# EAGLE design Motherboard_STM32F405RG (EAGLE 7.7.0)

## Sheet 1 of 2
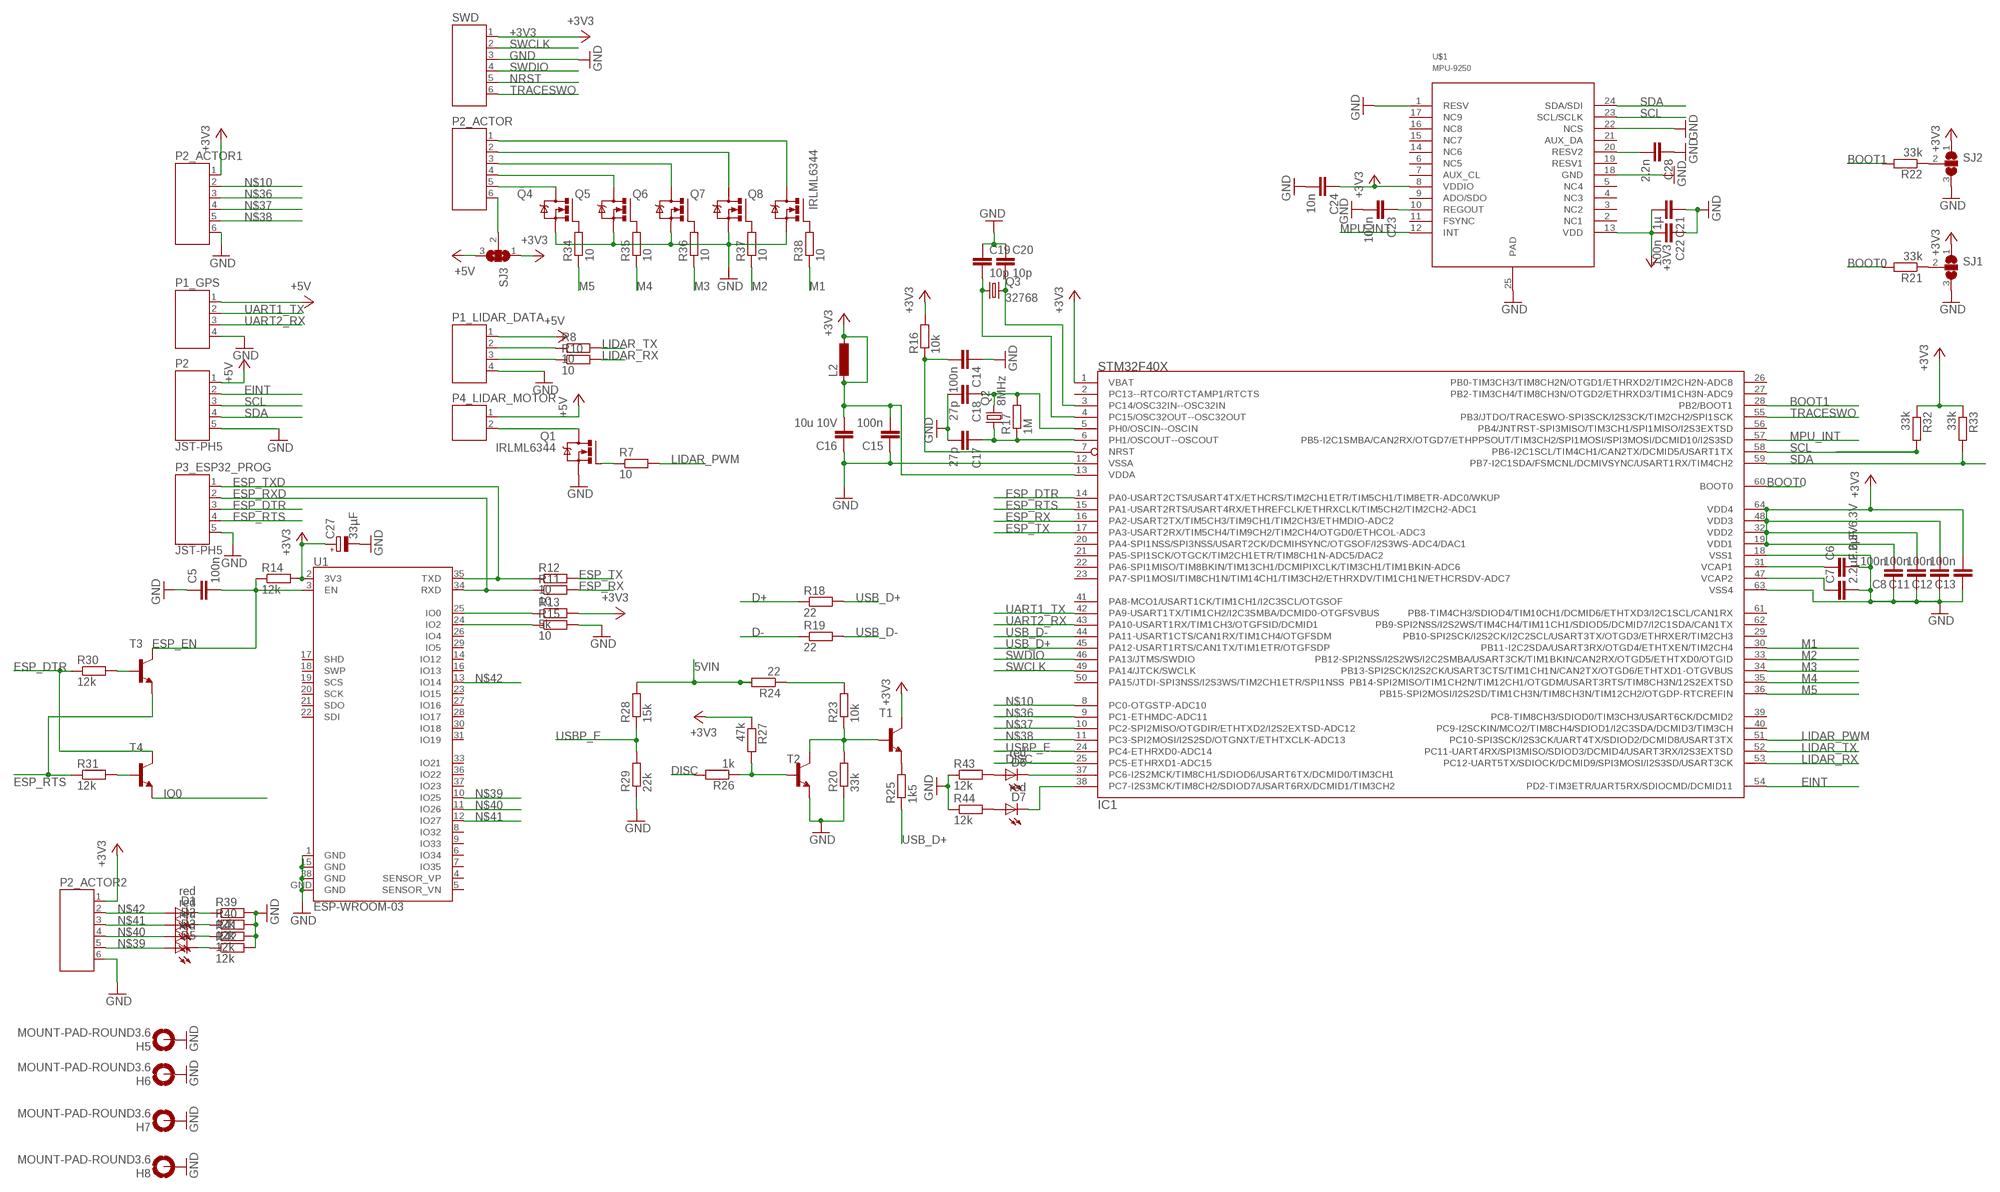
[diagram p0: schematic, sheet 1]

### Parts
C5  100n  C-EUC0603  [C0603]
C6  2.2µF 6.3V  C-EUC0603  [C0603]
C7  2.2µF 6.3V  C-EUC0603  [C0603]
C8  100n  C-EUC0603  [C0603]
C11  100n  C-EUC0603  [C0603]
C12  100n  C-EUC0603  [C0603]
C13  100n  C-EUC0603  [C0603]
C14  100n  C-EUC0603  [C0603]
C15  100n  C-EUC0603  [C0603]
C16  10u 10V  C-EUC1206  [C1206]
C17  27p  C-EUC0603  [C0603]
C18  27p  C-EUC0603  [C0603]
C19  10p  C-EUC0603  [C0603]
C20  10p  C-EUC0603  [C0603]
C21  1µ  C-EUC0603  [C0603]
C22  100n  C-EUC0603  [C0603]
C23  100n  C-EUC0603  [C0603]
C24  10n  C-EUC0603  [C0603]
C27  33µF  CPOL-EUA/3216-18W  [A/3216-18W]
C28  2.2n  C-EUC0603  [C0603]
D1  red  LED0603  [LED-0603]
D2  red  LED0603  [LED-0603]
D3  red  LED0603  [LED-0603]
D5  red  LED0603  [LED-0603]
D6  red  LED0603  [LED-0603]
D7  red  LED0603  [LED-0603]
H5  MOUNT-PAD-ROUND3.6  [3,6-PAD]
H6  MOUNT-PAD-ROUND3.6  [3,6-PAD]
H7  MOUNT-PAD-ROUND3.6  [3,6-PAD]
H8  MOUNT-PAD-ROUND3.6  [3,6-PAD]
IC1  STM32F40X  [LQFP64]
L2  L-EUL1812  [L1812]
P1_GPS  JST-PH4  [JST-PH4]
P1_LIDAR_DATA  JST-PH4  [JST-PH4]
P2  JST-PH5  [JST-PH5]
P2_ACTOR  JST-PH6  [JST-PH6]
P2_ACTOR1  JST-PH6  [JST-PH6]
P2_ACTOR2  JST-PH6  [JST-PH6]
P3_ESP32_PROG  JST-PH5  [JST-PH5]
P4_LIDAR_MOTOR  JST-PH2  [JST-PH2]
Q1  IRLML6344  [SOT23]
Q2  8MHz  CRYSTALHC18U-V  [HC18U-V]
Q3  32768  CRYSTALTC38H  [TC38H]
Q4  IRLML6344  [SOT23]
Q5  IRLML6344  [SOT23]
Q6  IRLML6344  [SOT23]
Q7  IRLML6344  [SOT23]
Q8  IRLML6344  [SOT23]
R7  10  R-EU_R0603  [R0603]
R8  10  R-EU_R0603  [R0603]
R10  10  R-EU_R0603  [R0603]
R11  10  R-EU_R0603  [R0603]
R12  10  R-EU_R0603  [R0603]
R13  5k  R-EU_R0603  [R0603]
R14  12k  R-EU_R0603  [R0603]
R15  10  R-EU_R0603  [R0603]
R16  10k  R-EU_R0603  [R0603]
R17  1M  R-EU_R0603  [R0603]
R18  22  R-EU_R0603  [R0603]
R19  22  R-EU_R0603  [R0603]
R20  33k  R-EU_R0603  [R0603]
R21  33k  R-EU_R0603  [R0603]
R22  33k  R-EU_R0603  [R0603]
R23  10k  R-EU_R0603  [R0603]
R24  22  R-EU_R0603  [R0603]
R25  1k5  R-EU_R0603  [R0603]
R26  1k  R-EU_R0603  [R0603]
R27  47k  R-EU_R0603  [R0603]
R28  15k  R-EU_R0603  [R0603]
R29  22k  R-EU_R0603  [R0603]
R30  12k  R-EU_R0603  [R0603]
R31  12k  R-EU_R0603  [R0603]
R32  33k  R-EU_R0603  [R0603]
R33  33k  R-EU_R0603  [R0603]
R34  10  R-EU_R0603  [R0603]
R35  10  R-EU_R0603  [R0603]
R36  10  R-EU_R0603  [R0603]
R37  10  R-EU_R0603  [R0603]
R38  10  R-EU_R0603  [R0603]
R39  12k  R-EU_R0603  [R0603]
R40  12k  R-EU_R0603  [R0603]
R41  12k  R-EU_R0603  [R0603]
R42  12k  R-EU_R0603  [R0603]
R43  12k  R-EU_R0603  [R0603]
R44  12k  R-EU_R0603  [R0603]
SJ1  SJ2W  [SJ_2]
SJ2  SJ2W  [SJ_2]
SJ3  SJ2W  [SJ_2]
SWD  JST-PH6  [JST-PH6]
T1  BC817-16-NPN-SOT23-BEC  [SOT23-BEC]
T2  BC817-16-NPN-SOT23-BEC  [SOT23-BEC]
T3  BC817-16-NPN-SOT23-BEC  [SOT23-BEC]
T4  BC817-16-NPN-SOT23-BEC  [SOT23-BEC]
U1  ESP-WROOM-03  [ESP-WROOM-03]
U$1  MPU-9250  [LEAD-QFN24]

### Nets
5VIN: R24.2 R28.2 ; also sheet 2
+3V3: C8.2 C11.2 C12.2 C13.2 C15.2 C16.2 C21.2 C22.2 C24.1 C27.+ IC1.1(VBAT) IC1.13(VDDA) IC1.19(VDD1) IC1.32(VDD2) IC1.48(VDD3) IC1.64(VDD4) L2.1 L2.2 P2_ACTOR1.1 P2_ACTOR2.1 R13.2 R14.2 R16.2 R27.1 R32.1 R33.1 SJ1.1 SJ2.1 SJ3.1 SWD.1 T1.C U1.2(3V3) U$1.8(VDDIO) U$1.13(VDD) ; also sheet 2
+5V: P1_GPS.1 P1_LIDAR_DATA.1 P2.1 P4_LIDAR_MOTOR.1 SJ3.3 ; also sheet 2
BOOT0: IC1.60(BOOT0) R21.2
BOOT1: IC1.28(PB2/BOOT1) R22.2
D+: R18.1 ; also sheet 2
D-: R19.1 ; also sheet 2
DISC: IC1.25(PC5-ETHRXD1-ADC15) R26.2
EINT: IC1.54(PD2-TIM3ETR/UART5RX/SDIOCMD/DCMID11) P2.2
ESP_DTR: IC1.14(PA0-USART2CTS/USART4TX/ETHCRS/TIM2CH1ETR/TIM5CH1/TIM8ETR-ADC0/WKUP) P3_ESP32_PROG.3 R30.1 T4.C
ESP_EN: C5.2 R14.1 T3.C U1.3(EN)
ESP_RTS: IC1.15(PA1-USART2RTS/USART4RX/ETHREFCLK/ETHRXCLK/TIM5CH2/TIM2CH2-ADC1) P3_ESP32_PROG.4 R31.1 T3.E
ESP_RX: IC1.16(PA2-USART2TX/TIM5CH3/TIM9CH1/TIM2CH3/ETHMDIO-ADC2) R11.2
ESP_RXD: P3_ESP32_PROG.2 R11.1 U1.34(RXD)
ESP_TX: IC1.17(PA3-USART2RX/TIM5CH4/TIM9CH2/TIM2CH4/OTGD0/ETHCOL-ADC3) R12.2
ESP_TXD: P3_ESP32_PROG.1 R12.1 U1.35(TXD)
GND: C5.1 C6.2 C7.2 C8.1 C11.1 C12.1 C13.1 C14.1 C15.1 C16.1 C17.2 C18.2 C19.1 C20.1 C21.1 C22.1 C23.2 C24.2 C27.- C28.1 H5.B3,6(MOUNT) H6.B3,6(MOUNT) H7.B3,6(MOUNT) H8.B3,6(MOUNT) IC1.12(VSSA) IC1.18(VSS1) IC1.63(VSS4) P1_GPS.4 P1_LIDAR_DATA.4 P2.5 P2_ACTOR1.6 P2_ACTOR2.6 P3_ESP32_PROG.5 Q1.2(S) Q4.2(S) Q5.2(S) Q6.2(S) Q7.2(S) Q8.2(S) R15.2 R20.1 R29.1 R39.2 R40.2 R41.2 R42.2 R43.1 R44.1 SJ1.3 SJ2.3 SWD.3 T2.E U1.1(GND) U1.15(GND) U1.38(GND) U1.GND U$1.1(RESV) U$1.18(GND) U$1.22(NCS) U$1.25(PAD) ; also sheet 2
IO0: R13.1 T4.E U1.25(IO0)
IO2: R15.1 U1.24(IO2)
LIDAR_PWM: IC1.51(PC10-SPI3SCK/I2S3CK/UART4TX/SDIOD2/DCMID8/USART3TX) R7.2
LIDAR_RX: IC1.53(PC12-UART5TX/SDIOCK/DCMID9/SPI3MOSI/I2S3SD/USART3CK) R10.2
LIDAR_TX: IC1.52(PC11-UART4RX/SPI3MISO/SDIOD3/DCMID4/USART3RX/I2S3EXTSD) R8.2
M1: IC1.30(PB11-I2C2SDA/USART3RX/OTGD4/ETHTXEN/TIM2CH4) R38.1
M2: IC1.33(PB12-SPI2NSS/I2S2WS/I2C2SMBA/USART3CK/TIM1BKIN/CAN2RX/OTGD5/ETHTXD0/OTGID) R37.1
M3: IC1.34(PB13-SPI2SCK/I2S2CK/USART3CTS/TIM1CH1N/CAN2TX/OTGD6/ETHTXD1-OTGVBUS) R36.1
M4: IC1.35(PB14-SPI2MISO/TIM1CH2N/TIM12CH1/OTGDM/USART3RTS/TIM8CH3N/12S2EXTSD) R35.1
M5: IC1.36(PB15-SPI2MOSI/I2S2SD/TIM1CH3N/TIM8CH3N/TIM12CH2/OTGDP-RTCREFIN) R34.1
MPU_INT: IC1.57(PB5-I2C1SMBA/CAN2RX/OTGD7/ETHPPSOUT/TIM3CH2/SPI1MOSI/SPI3MOSI/DCMID10/I2S3SD) U$1.12(INT)
N$3: C28.2 U$1.20(RESV2)
N$4: P4_LIDAR_MOTOR.2 Q1.3(D)
N$5: Q1.1(G) R7.1
N$6: P1_LIDAR_DATA.2 R8.1
N$7: P1_LIDAR_DATA.3 R10.1
N$9: C23.1 U$1.10(REGOUT)
N$10: IC1.8(PC0-OTGSTP-ADC10) P2_ACTOR1.2
N$12: P2_ACTOR.5 Q4.3(D)
N$13: R31.2 T4.B
N$15: P2_ACTOR.4 Q5.3(D)
N$16: C17.1 IC1.6(PH1/OSCOUT--OSCOUT) Q2.1 R17.1
N$17: P2_ACTOR.3 Q6.3(D)
N$18: P2_ACTOR.2 Q7.3(D)
N$19: C18.1 IC1.5(PH0/OSCIN--OSCIN) Q2.2 R17.2
N$20: C19.2 IC1.4(PC15/OSC32OUT--OSC32OUT) Q3.1
N$21: C20.2 IC1.3(PC14/OSC32IN--OSC32IN) Q3.2
N$22: R20.2 R23.1 T1.B T2.C
N$23: R21.1 SJ1.2
N$24: R22.1 SJ2.2
N$25: P2_ACTOR.1 Q8.3(D)
N$26: R25.2 T1.E
N$27: R23.2 R24.1
N$28: R26.1 R27.2 T2.B
N$29: R30.2 T3.B
N$30: P2_ACTOR.6 SJ3.2
N$31: Q4.1(G) R34.2
N$32: Q5.1(G) R35.2
N$33: Q6.1(G) R36.2
N$34: Q7.1(G) R37.2
N$35: Q8.1(G) R38.2
N$36: IC1.9(PC1-ETHMDC-ADC11) P2_ACTOR1.3
N$37: IC1.10(PC2-SPI2MISO/OTGDIR/ETHTXD2/I2S2EXTSD-ADC12) P2_ACTOR1.4
N$38: IC1.11(PC3-SPI2MOSI/I2S2SD/OTGNXT/ETHTXCLK-ADC13) P2_ACTOR1.5
N$39: D5.A P2_ACTOR2.5 U1.10(IO25)
N$40: D3.A P2_ACTOR2.4 U1.11(IO26)
N$41: D2.A P2_ACTOR2.3 U1.12(IO27)
N$42: D1.A P2_ACTOR2.2 U1.13(IO14)
N$43: D1.C R39.1
N$44: D2.C R40.1
N$45: D3.C R41.1
N$46: D5.C R42.1
N$48: D6.C IC1.37(PC6-I2S2MCK/TIM8CH1/SDIOD6/USART6TX/DCMID0/TIM3CH1)
N$49: D7.C IC1.38(PC7-I2S3MCK/TIM8CH2/SDIOD7/USART6RX/DCMID1/TIM3CH2)
N$50: D6.A R43.2
N$51: D7.A R44.2
NRST: C14.2 IC1.7(NRST) R16.1 SWD.5
SCL: IC1.58(PB6-I2C1SCL/TIM4CH1/CAN2TX/DCMID5/USART1TX) P2.3 R32.2 U$1.23(SCL/SCLK)
SDA: IC1.59(PB7-I2C1SDA/FSMCNL/DCMIVSYNC/USART1RX/TIM4CH2) P2.4 R33.2 U$1.24(SDA/SDI)
SWCLK: IC1.49(PA14/JTCK/SWCLK) SWD.2
SWDIO: IC1.46(PA13/JTMS/SWDIO) SWD.4
TRACESWO: IC1.55(PB3/JTDO/TRACESWO-SPI3SCK/I2S3CK/TIM2CH2/SPI1SCK) SWD.6
UART1_TX: IC1.42(PA9-USART1TX/TIM1CH2/I2C3SMBA/DCMID0-OTGFSVBUS) P1_GPS.2
UART2_RX: IC1.43(PA10-USART1RX/TIM1CH3/OTGFSID/DCMID1) P1_GPS.3
USB_D+: IC1.45(PA12-USART1RTS/CAN1TX/TIM1ETR/OTGFSDP) R18.2 R25.1
USB_D-: IC1.44(PA11-USART1CTS/CAN1RX/TIM1CH4/OTGFSDM) R19.2
USBP_E: IC1.24(PC4-ETHRXD0-ADC14) R28.1 R29.2
VCAP1: C6.1 IC1.31(VCAP1)
VCAP2: C7.1 IC1.47(VCAP2)
Unconnected: IC1.2(PC13--RTCO/RTCTAMP1/RTCTS) IC1.20(PA4-SPI1NSS/SPI3NSS/USART2CK/DCMIHSYNC/OTGSOF/I2S3WS-ADC4/DAC1) IC1.21(PA5-SPI1SCK/OTGCK/TIM2CH1ETR/TIM8CH1N-ADC5/DAC2) IC1.22(PA6-SPI1MISO/TIM8BKIN/TIM13CH1/DCMIPIXCLK/TIM3CH1/TIM1BKIN-ADC6) IC1.23(PA7-SPI1MOSI/TIM8CH1N/TIM14CH1/TIM3CH2/ETHRXDV/TIM1CH1N/ETHCRSDV-ADC7) IC1.26(PB0-TIM3CH3/TIM8CH2N/OTGD1/ETHRXD2/TIM2CH2N-ADC8) IC1.27(PB2-TIM3CH4/TIM8CH3N/OTGD2/ETHRXD3/TIM1CH3N-ADC9) IC1.29(PB10-SPI2SCK/I2S2CK/I2C2SCL/USART3TX/OTGD3/ETHRXER/TIM2CH3) IC1.39(PC8-TIM8CH3/SDIOD0/TIM3CH3/USART6CK/DCMID2) IC1.40(PC9-I2SCKIN/MCO2/TIM8CH4/SDIOD1/I2C3SDA/DCMID3/TIM3CH) IC1.41(PA8-MCO1/USART1CK/TIM1CH1/I2C3SCL/OTGSOF) IC1.50(PA15/JTDI-SPI3NSS/I2S3WS/TIM2CH1ETR/SPI1NSS) IC1.56(PB4/JNTRST-SPI3MISO/TIM3CH1/SPI1MISO/I2S3EXTSD) IC1.61(PB8-TIM4CH3/SDIOD4/TIM10CH1/DCMID6/ETHTXD3/I2C1SCL/CAN1RX) IC1.62(PB9-SPI2NSS/I2S2WS/TIM4CH4/TIM11CH1/SDIOD5/DCMID7/I2C1SDA/CAN1TX) U1.4(SENSOR_VP) U1.5(SENSOR_VN) U1.6(IO34) U1.7(IO35) U1.8(IO32) U1.9(IO33) U1.14(IO12) U1.16(IO13) U1.17(SHD) U1.18(SWP) U1.19(SCS) U1.20(SCK) U1.21(SDO) U1.22(SDI) U1.23(IO15) U1.26(IO4) U1.27(IO16) U1.28(IO17) U1.29(IO5) U1.30(IO18) U1.31(IO19) U1.33(IO21) U1.36(IO22) U1.37(IO23) U$1.2(NC1) U$1.3(NC2) U$1.4(NC3) U$1.5(NC4) U$1.6(NC5) U$1.7(AUX_CL) U$1.9(ADO/SDO) U$1.11(FSYNC) U$1.14(NC6) U$1.15(NC7) U$1.16(NC8) U$1.17(NC9) U$1.19(RESV1) U$1.21(AUX_DA)

## Sheet 2 of 2
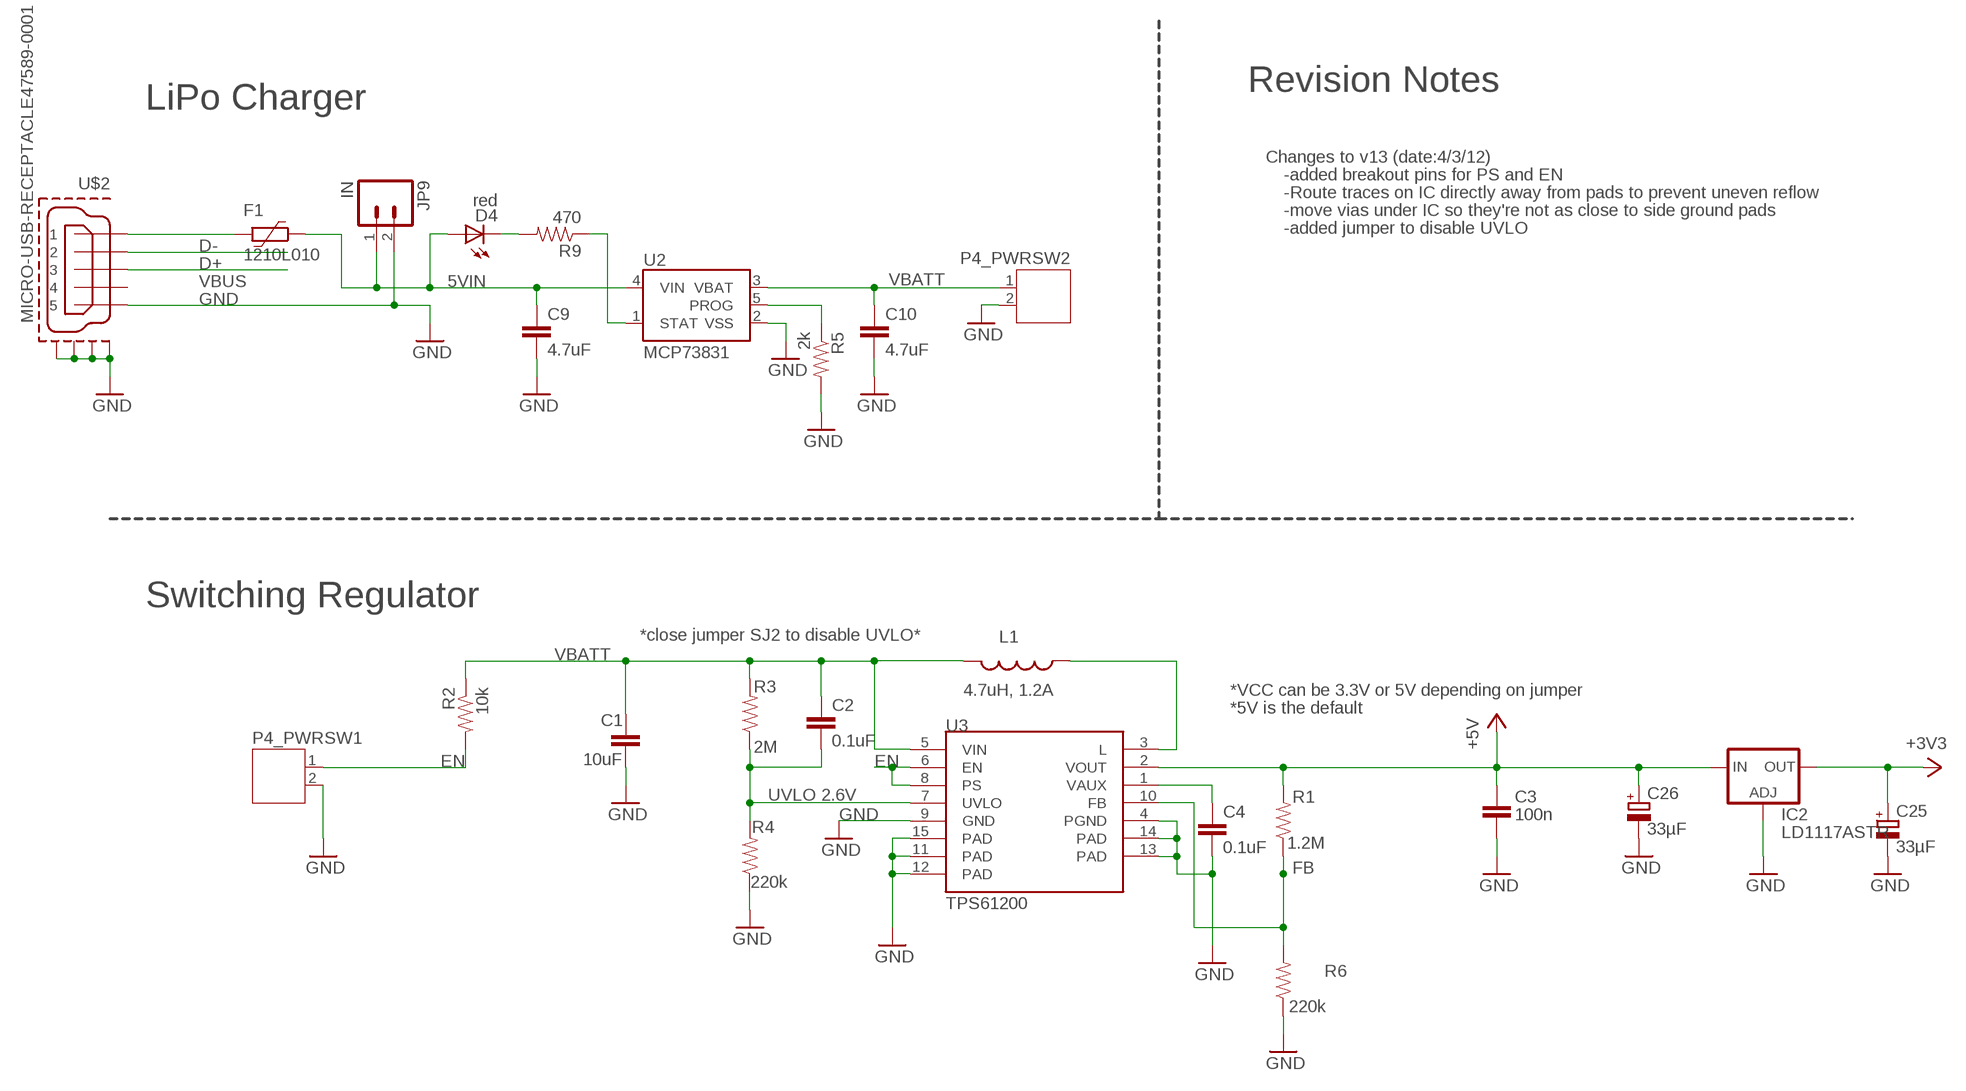
[diagram p1: schematic, sheet 2]

### Parts
C1  10uF  CAP1206  [1206]
C2  0.1uF  CAP0603-CAP  [0603-CAP]
C3  100n  CAP0805  [0805]
C4  0.1uF  CAP0603-CAP  [0603-CAP]
C9  4.7uF  CAP0603-CAP  [0603-CAP]
C10  4.7uF  CAP0603-CAP  [0603-CAP]
C25  33µF  CPOL-EUA/3216-18W  [A/3216-18W]
C26  33µF  CPOL-EUA/3216-18W  [A/3216-18W]
D4  red  LED0603  [LED-0603]
F1  1210L010  [1210L]
IC2  LD1117ASTR  LD117ASTR  [SOT223]
JP9  IN  M02PTH  [1X02]
L1  4.7uH, 1.2A  INDUCTOR.  [CDRH2D09]
P4_PWRSW1  JST-PH2  [JST-PH2]
P4_PWRSW2  JST-PH2  [JST-PH2]
R1  1.2M  RESISTOR0603-RES  [0603-RES]
R2  10k  RESISTOR0603-RES  [0603-RES]
R3  2M  RESISTOR0603-RES  [0603-RES]
R4  220k  RESISTOR0603-RES  [0603-RES]
R5  2k  RESISTOR0603-RES  [0603-RES]
R6  220k  RESISTOR0603-RES  [0603-RES]
R9  470  RESISTOR0603-RES  [0603-RES]
U2  MCP73831  [SOT23-5]
U3  TPS61200  [QFN-10_PAD]
U$2  MICRO-USB-RECEPTACLE47589-0001  [47589-0001]

### Nets
5VIN: C9.1 D4.A F1.1 JP9.1 U2.4(VIN) ; also sheet 1
+3V3: C25.+ IC2.2(OUT) IC2.4(OUT) ; also sheet 1
+5V: C3.1 C26.+ IC2.3(IN) R1.2 U3.2(VOUT) ; also sheet 1
D+: U$2.3 ; also sheet 1
D-: U$2.2 ; also sheet 1
EN: P4_PWRSW1.1 R2.2 U3.6(EN) U3.8(PS)
FB: R1.1 R6.2 U3.10(FB)
GND: C1.2 C3.2 C4.2 C9.2 C10.2 C25.- C26.- IC2.1(ADJ) JP9.2 P4_PWRSW1.2 P4_PWRSW2.2 R4.1 R5.2 R6.1 U2.2(VSS) U3.4(PGND) U3.9(GND) U3.11(PAD) U3.12(PAD) U3.13(PAD) U3.14(PAD) U3.15(PAD) U$2.5 U$2.CASING1(GND1) U$2.CASING2(GND2) U$2.CASING3(GND3) U$2.CASING4(GND4) ; also sheet 1
N$1: C4.1 U3.1(VAUX)
N$2: L1.P$1 U3.3(L)
N$8: D4.C R9.2
N$11: R5.1 U2.5(PROG)
N$14: R9.1 U2.1(STAT)
UVLO: C2.2 R3.1 R4.2 U3.7(UVLO)
VBATT: C1.1 C2.1 C10.1 L1.P$2 P4_PWRSW2.1 R2.1 R3.2 U2.3(VBAT) U3.5(VIN)
VBUS: F1.2 U$2.1
Unconnected: U$2.4

### Notes on the sheet
- Revision Notes
- LiPo Charger
- Changes to v13 (date:4/3/12)
- -added breakout pins for PS and EN
- -Route traces on IC directly away from pads to prevent uneven reflow
- -move vias under IC so they're not as close to side ground pads
- -added jumper to disable UVLO
- Switching Regulator
- *close jumper SJ2 to disable UVLO*
- *VCC can be 3.3V or 5V depending on jumper
- *5V is the default
- UVLO 2.6V

## Library data of the parts
C1 = CH_passive:CAP: Capacitor Standard 0603 ceramic capacitor, and 0.1" leaded capacitor.; MF: KEMET; MPN: C1206C106K8RACTU; OC_FARNELL: 1288264
C2 C4 = SparkFun:CAP: Capacitor Standard 0603 ceramic capacitor, and 0.1" leaded capacitor.; MF: YAGEO (PHYCOMP); MPN: CC0603MRY5V9BB104; OC_FARNELL: 431989
C3 = CH_passive:CAP: Capacitor Standard 0603 ceramic capacitor, and 0.1" leaded capacitor.; MF: KEMET; MPN: C0603C104K5RACTU; OC_FARNELL: 1288255
C5 C8 C11-C15 C22 C23 = rcl:C-EU: CAPACITOR, European symbol; MF: KEMET; MPN: C0603C104K5RACTU; OC_FARNELL: 1288255
C6 C7 = rcl:C-EU: CAPACITOR, European symbol; MF: KEMET; MPN: C0603C225K9PACTU; OC_FARNELL: 1288257
C9 C10 = SparkFun:CAP: Capacitor Standard 0603 ceramic capacitor, and 0.1" leaded capacitor.; MF: KEMET; MPN: C0603C475K8PACTU; OC_FARNELL: 1572625
C16 = rcl:C-EU: CAPACITOR, European symbol; MF: KEMET; MPN: C1206C106K8RACTU; OC_FARNELL: 1288264
C17 C18 = rcl:C-EU: CAPACITOR, European symbol; MF: YAGEO (PHYCOMP); MPN: CC0603JRNPO9BN270; OC_FARNELL: 722017
C19 C20 = rcl:C-EU: CAPACITOR, European symbol; MF: AVX; MPN: 06035A102JAT2A; OC_FARNELL: 317202
C21 = rcl:C-EU: CAPACITOR, European symbol; MF: AVX; MPN: 0603YC105KAT2A; OC_FARNELL: 1658870
C24 = rcl:C-EU: CAPACITOR, European symbol; MF: YAGEO (PHYCOMP); MPN: CC0603KRX7R9BB103; OC_FARNELL: 722236
C25-C27 = rcl:CPOL-EU: POLARIZED CAPACITOR, European symbol; MF: AVX; MPN: TPSA336M006R0600; OC_FARNELL: 2333095
C28 = rcl:C-EU: CAPACITOR, European symbol; MF: YAGEO (PHYCOMP); MPN: CC0603KRX7R9BB222; OC_FARNELL: 722194
D1-D7 = SparkFun:LED: LEDs Standard schematic elements and footprints for 5mm, 3mm, 1206, and 0603 sized LEDs. 5mm - Spark Fun Electronics SKU : COM-00529 (and others); MF: OSRAM; MPN: LSQ976-Z; OC_FARNELL: 1226390
F1 = polyfuse-smd_10:?: Polyfuse Resettable PTC Source: http://www.littelfuse.com/products/resettable-ptcs.aspx; MF: LITTELFUSE; MPN: 1210L010WR; OC_FARNELL: 1822206; OC_NEWARK: 18M4781
H5-H8 = holes_new:MOUNT-PAD-ROUND: MOUNTING PAD, round; OC_FARNELL: unknown
IC1 = pel_stm32:STM32F40X; MF: STMICROELECTRONICS; MPN: STM32F405RGT6; OC_FARNELL: 2064363
IC2 = v-reg:LD117A?*: Low drop fixed and adjustable positive voltage regulators 1 A Source: http://www.st.com/stonline/products/literature/ds/7194/ld1117axx.pdf; MF: ON SEMICONDUCTOR; MPN: NCP1117ST33T3G; OC_FARNELL: 1652366
JP9 = SparkFun:M02: Header 2 Standard 2-pin 0.1" header. Use with straight break away headers (SKU : PRT-00116), right angle break away headers (PRT-00553), swiss pins (PRT-00743), machine pins (PRT-00117), and female headers (PRT-00115). Molex polarized connector foot print use with SKU : PRT-08233 with associated crimp pins and housings.; MF: JST (JAPAN SOLDERLESS TERMINALS); MPN: B2B-PH-K-S(LF)(SN); OC_FARNELL: 9491856
L1 = SparkFun:INDUCTOR: Inductors Basic Inductor/Choke - 0603 and 1206. Footprints are not proven and vary greatly between part numbers.; MF: MURATA; MPN: LQH3NPN4R7MJ0L; OC_FARNELL: 2219271
L2 = rcl:L-EU: INDUCTOR, European symbol; OC_FARNELL: unknown
P1_GPS P1_LIDAR_DATA = jst-ph:JST-PH4; MF: JST (JAPAN SOLDERLESS TERMINALS); MPN: B4B-PH-K-S(LF)(SN); OC_FARNELL: 9492437
P2 P3_ESP32_PROG = jst-ph:JST-PH5; MF: JST (JAPAN SOLDERLESS TERMINALS); MPN: B5B-PH-K-S(LF)(SN); OC_FARNELL: 9492445
P2_ACTOR P2_ACTOR1 P2_ACTOR2 SWD = jst-ph:JST-PH6; MF: JST (JAPAN SOLDERLESS TERMINALS); MPN: B6B-PH-K-S(LF)(SN); OC_FARNELL: 9492453
P4_LIDAR_MOTOR P4_PWRSW1 P4_PWRSW2 = jst-ph:JST-PH2; MF: JST (JAPAN SOLDERLESS TERMINALS); MPN: B2B-PH-K-S(LF)(SN); OC_FARNELL: 9491856
Q1 Q4-Q8 = myDBv7:IRLML6344; MF: INFINEON; MPN: IRLML6344TRPBF; OC_FARNELL: 1857299
Q2 = crystal:CRYSTAL: CRYSTAL; MF: MULTICOMP; MPN: HC49S-8-30-50-70-30-ATF; OC_FARNELL: 1666997; OC_NEWARK: unknown
Q3 = crystal:CRYSTAL: CRYSTAL; MF: CITIZEN FINETECH MIYOTA; MPN: CFS206 32.768KDZB-UB; OC_FARNELL: 1457085; OC_NEWARK: unknown
R1 = SparkFun:RESISTOR: Resistor Basic schematic elements and footprints for 0603, 1206, and PTH resistors.; MF: MULTICOMP; MPN: MCMR06W2004FTL; OC_FARNELL: 2073340
R2 = SparkFun:RESISTOR: Resistor Basic schematic elements and footprints for 0603, 1206, and PTH resistors.; MF: MULTICOMP; MPN: MCMR06X1002FTL; OC_FARNELL: 2073349
R3 = SparkFun:RESISTOR: Resistor Basic schematic elements and footprints for 0603, 1206, and PTH resistors.; MF: KOA SPEER ELECTRONICS; MPN: RK73H1JTTD1204F; OC_FARNELL: 1811595
R4 R6 = SparkFun:RESISTOR: Resistor Basic schematic elements and footprints for 0603, 1206, and PTH resistors.; MF: MULTICOMP; MPN: MCHP03W8F2203T5E; OC_FARNELL: 1576314
R5 = SparkFun:RESISTOR: Resistor Basic schematic elements and footprints for 0603, 1206, and PTH resistors.; MF: YAGEO (PHYCOMP); MPN: RC0603FR-072K2L.; OC_FARNELL: 9238522
R7 R8 R10-R16 R34-R38 = rcl:R-EU_: RESISTOR, European symbol; MF: VISHAY; MPN: CRCW060310R0FKEA; OC_FARNELL: 1469751
R9 = SparkFun:RESISTOR: Resistor Basic schematic elements and footprints for 0603, 1206, and PTH resistors.; MF: MULTICOMP; MPN: MCHP03W8F4700T5E; OC_FARNELL: 1576273
R17 = rcl:R-EU_: RESISTOR, European symbol; MF: VISHAY; MPN: CRCW06031M00FKEA; OC_FARNELL: 1469746
R18 R19 R24 = rcl:R-EU_: RESISTOR, European symbol; MF: VISHAY; MPN: CRCW060322R0FKEA; OC_FARNELL: 1469781
R20-R22 R32 R33 = rcl:R-EU_: RESISTOR, European symbol; MF: VISHAY; MPN: CRCW060333K0FKEA; OC_FARNELL: 1469801
R23 = rcl:R-EU_: RESISTOR, European symbol; MF: MULTICOMP; MPN: MCMR06X1002FTL; OC_FARNELL: 2073349
R25 = rcl:R-EU_: RESISTOR, European symbol; MF: MULTICOMP; MPN: MCMR06X1501FTL; OC_FARNELL: 2073391
R26 = rcl:R-EU_: RESISTOR, European symbol; MF: VISHAY; MPN: CRCW06031K00FKEA; OC_FARNELL: 1469740
R27 = rcl:R-EU_: RESISTOR, European symbol; MF: VISHAY; MPN: CRCW060347K0FKEA; OC_FARNELL: 1469811
R28 = rcl:R-EU_: RESISTOR, European symbol; MF: VISHAY; MPN: CRCW060315K0FKEA; OC_FARNELL: 1469758
R29 = rcl:R-EU_: RESISTOR, European symbol; MF: TE CONNECTIVITY / NEOHM; MPN: CPF0603F4K22C1; OC_FARNELL: 1527541
R30 R31 R39-R44 = rcl:R-EU_: RESISTOR, European symbol; MF: MULTICOMP; MPN: MC0063W060312K8; OC_FARNELL: 1170832
SJ1-SJ3 = jumper:SJ2W: SMD solder JUMPER; OC_FARNELL: unknown
T1-T4 = transistor:*-NPN-: NPN Transistror BF959 corrected 2008.03.06; MF: NEXPERIA; MPN: BC817,215; OC_FARNELL: 1081223
U1 = esp32:ESP-WROOM-03; OC_FARNELL: unknown
U2 = SparkFun:MCP73831: Microchip's MCP73831 Miniature single cell, fully integrated Li-Ion, Li-polymer charge management controller http://ww1.microchip.com/downloads/en/DeviceDoc/21984a.pdf; MF: MICROCHIP; MPN: MCP73831T-2ACI/OT; OC_FARNELL: 1332158
U3 = SparkFun:TPS61200: DC to DC Booster; MF: TEXAS INSTRUMENTS; MPN: TPS61200DRCT; OC_FARNELL: 1471238
U$1 = invensense:MPU-9250; MF: INVENSENSE; MPN: MPU-6050; OC_FARNELL: 1864742
U$2 = con-molex-usb:MICRO-USB-RECEPTACLE: MICRO USB RECEPTACLES Micro-USB Receptacles, SMT, Lead-Free from MOLEX <http://www.molex.com/>. (C) 2014 Tomasz Boleslaw CEDRO, cederom@tlen.pl, http://www.tomek.cedro.info. Version 0.1 (2014-01-17): Initial release. Version 0.2 (2014-02-06): Updated 47589-0001 footprint pins/pads/milling. Following devices are included: 1. 47589-0001 Micro-USB AB Receptacle, Bottom Mount, SMT, Lead-Free <http://www.molex.com/molex/products/datasheet.jsp?part=active/0475890001_IO_CONNECTORS.xml> (Technical Drawing <http://www.molex.com/pdm_docs/sd/475890001_sd.pdf>).; MF: MOLEX; MPN: 47589-0001; OC_FARNELL: 1568023

## Board
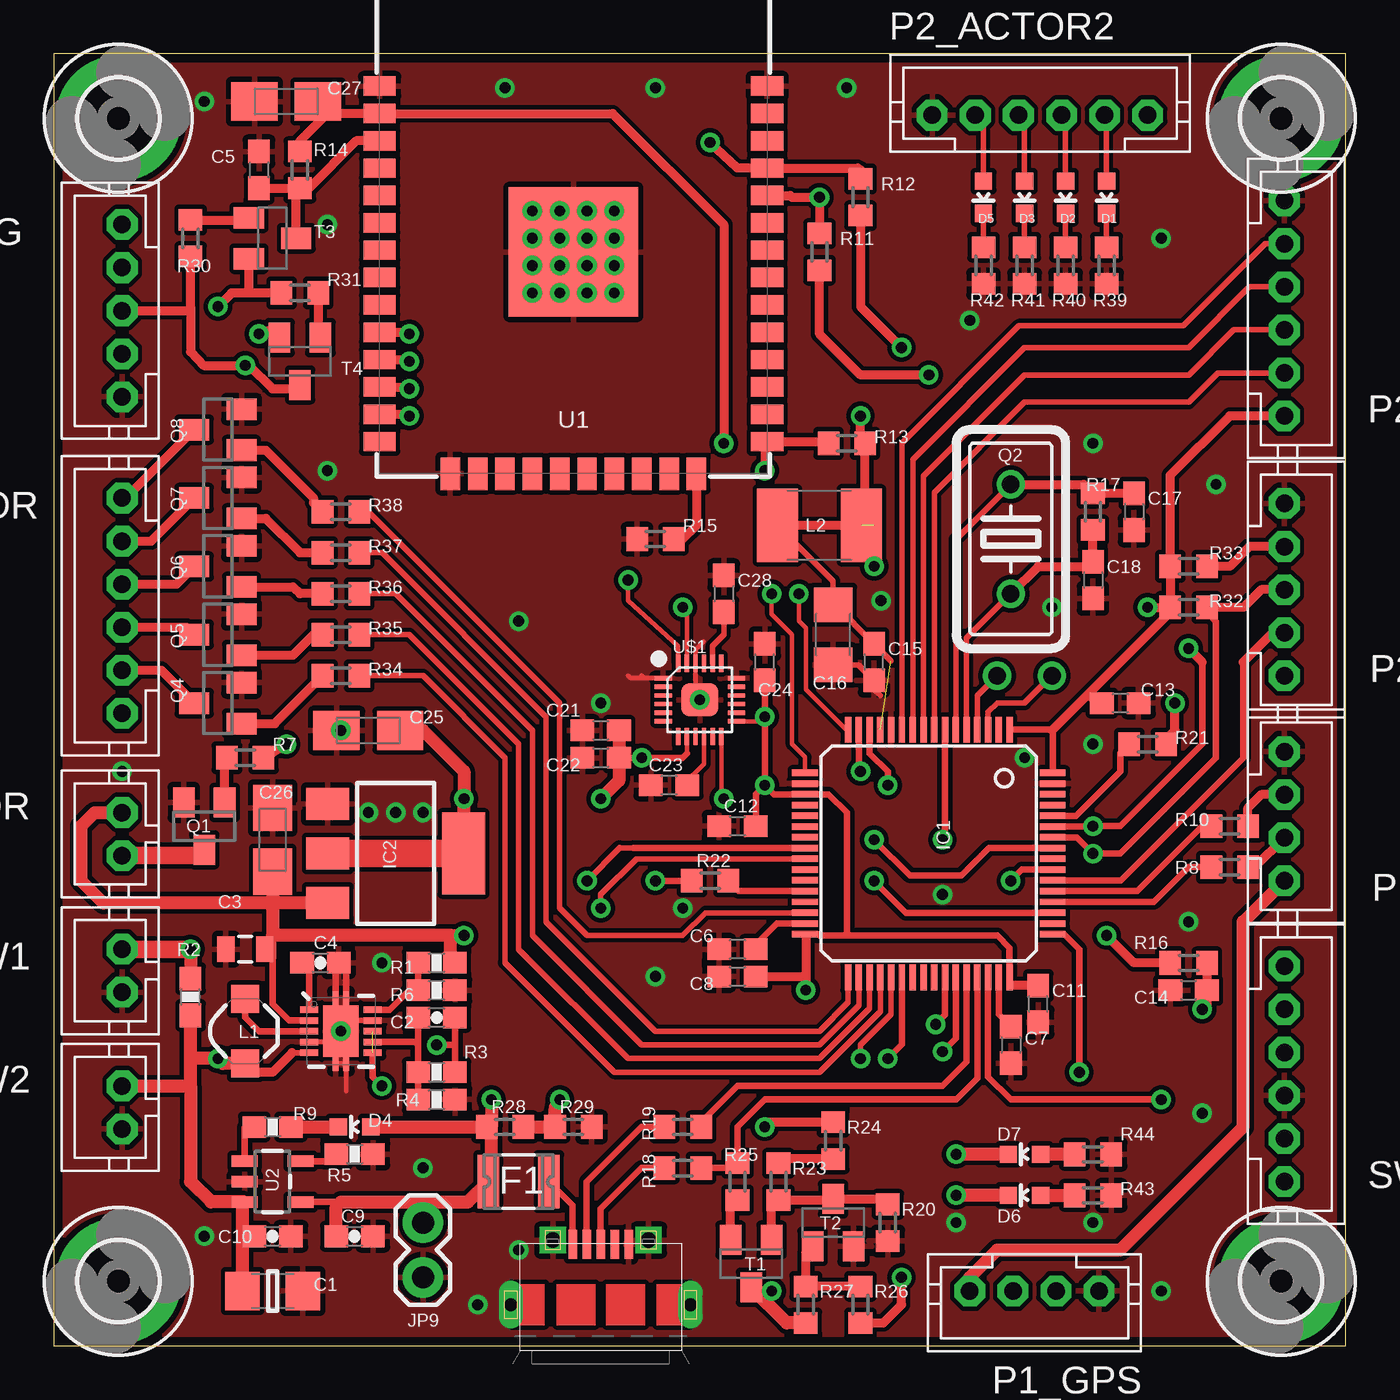
[diagram p2: board, top side]
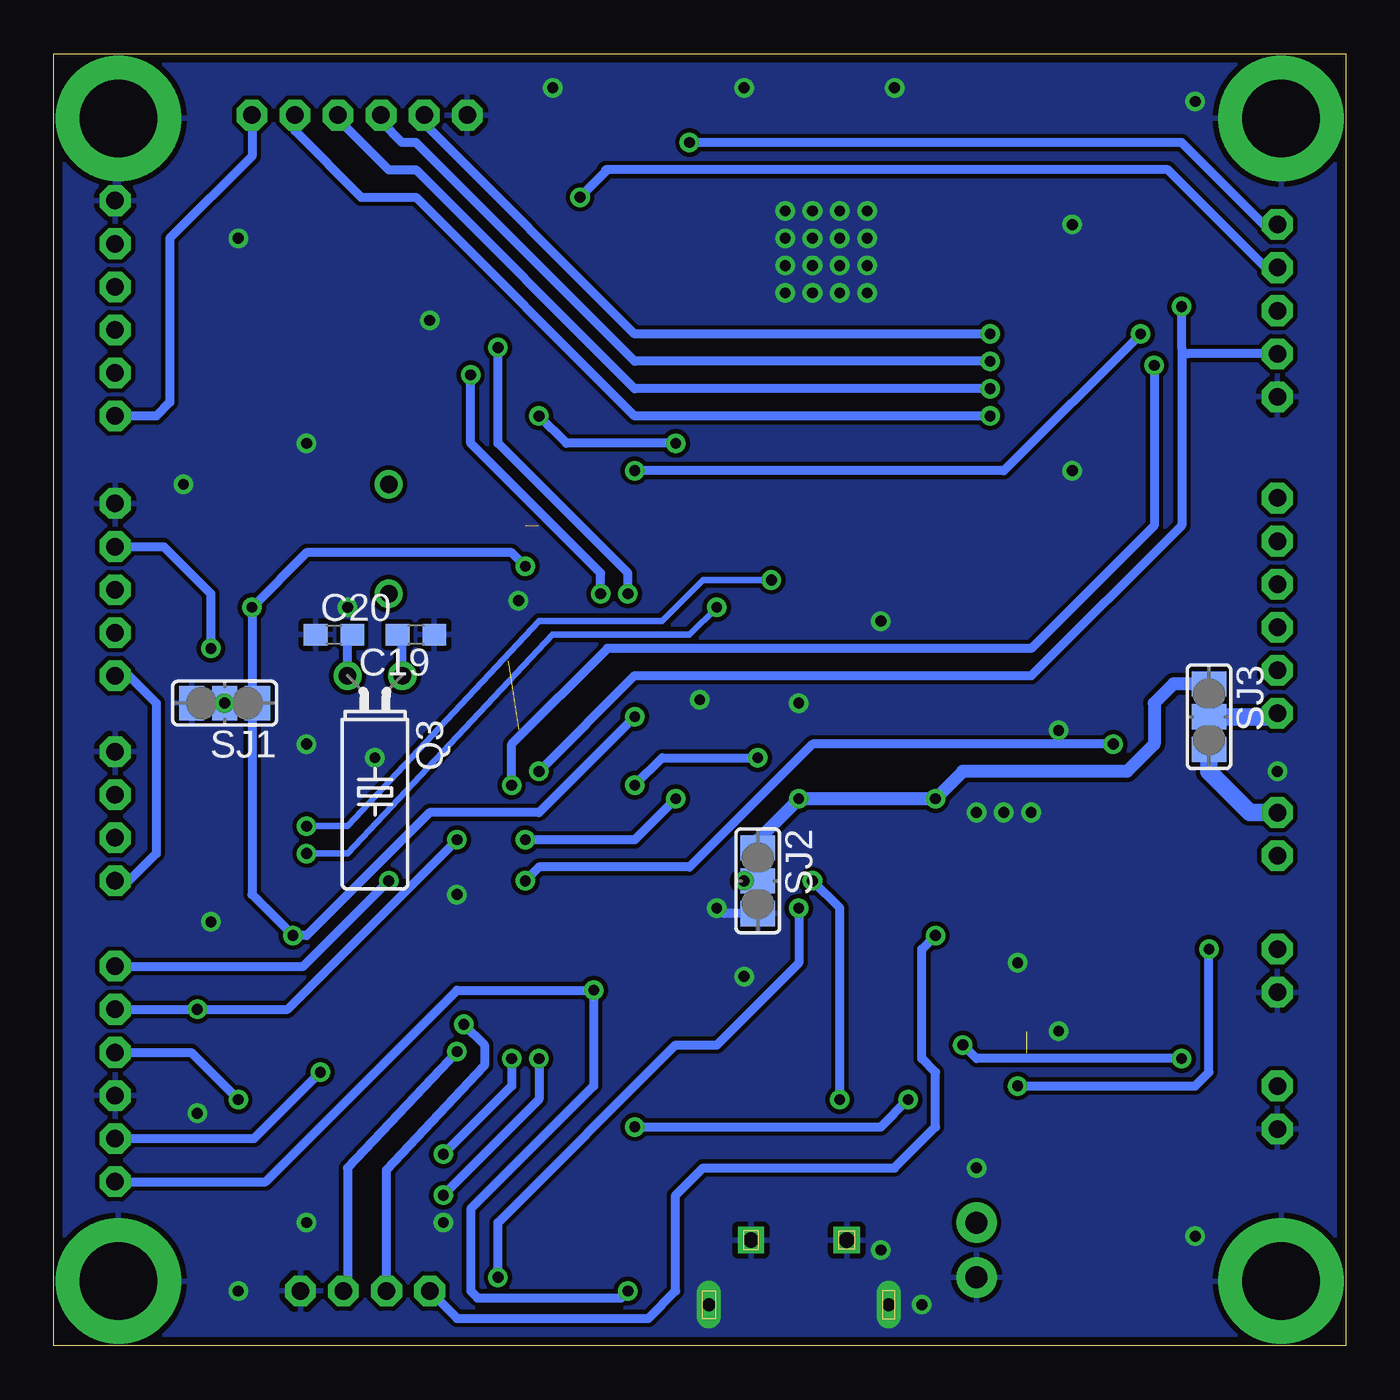
[diagram p3: board, bottom side, seen from below]

Size 60 x 60 mm. Coordinates in mm from the lower left corner, seen from the top.
Outline: 0,0 60,0 60,60 0,60 0,0
Copper layers (1*16): Top 0.035mm / dielectric 1.5mm / Bottom 0.035mm
Design rules "default *": minimum track width 10mil, minimum drill 0.6mm, track to track 8mil, track to pad 8mil, pad to pad 8mil, via to via 8mil, smd to smd 8mil, copper to edge 16mil, drill to drill 8mil, minimum pad ring 10mil, minimum via ring 8mil, stop-mask expansion 4mil, vias tented up to drill 0mil, thermal gap 10mil

### Footprints (pad centres in the part's own frame; a part is rotated, then mirrored left to right if it is on the bottom)
1206 = smd 1.6 x 1.8: 1 -1.4,0; 2 1.4,0
0603-CAP = smd 1.1 x 1: 1 -0.85,0; 2 0.85,0
0805 = smd 0.8 x 1.2: 1 -0.9,0; 2 0.9,0
C0603 = smd 1.1 x 1: 1 -0.85,0; 2 0.85,0
C1206 = smd 1.6 x 1.8: 1 -1.4,0; 2 1.4,0
A/3216-18W = smd 2.15 x 1.8: + 1.475,0; - -1.475,0
LED-0603 = smd 0.8 x 0.8: A 0,-0.75; C 0,0.75
1210L = smd 1 x 2.5: 1 -1.4,0; 2 1.4,0
3,6-PAD = drill 3.6 pad 5.842: B3,6 0,0
LQFP64 = smd 1.2 x 0.3: 1 -5.75,3.75; 2 -5.75,3.25; 3 -5.75,2.75; 4 -5.75,2.25; 5 -5.75,1.75; 6 -5.75,1.25; 7 -5.75,0.75; 8 -5.75,0.25; 9 -5.75,-0.25; 10 -5.75,-0.75; 11 -5.75,-1.25; 12 -5.75,-1.75; 13 -5.75,-2.25; 14 -5.75,-2.75; 15 -5.75,-3.25; 16 -5.75,-3.75; 33 5.75,-3.75; 34 5.75,-3.25; 35 5.75,-2.75; 36 5.75,-2.25; 37 5.75,-1.75; 38 5.75,-1.25; 39 5.75,-0.75; 40 5.75,-0.25; 41 5.75,0.25; 42 5.75,0.75; 43 5.75,1.25; 44 5.75,1.75; 45 5.75,2.25; 46 5.75,2.75; 47 5.75,3.25; 48 5.75,3.75 | smd 0.3 x 1.2: 17 -3.75,-5.75; 18 -3.25,-5.75; 19 -2.75,-5.75; 20 -2.25,-5.75; 21 -1.75,-5.75; 22 -1.25,-5.75; 23 -0.75,-5.75; 24 -0.25,-5.75; 25 0.25,-5.75; 26 0.75,-5.75; 27 1.25,-5.75; 28 1.75,-5.75; 29 2.25,-5.75; 30 2.75,-5.75; 31 3.25,-5.75; 32 3.75,-5.75; 49 3.75,5.75; 50 3.25,5.75; 51 2.75,5.75; 52 2.25,5.75; 53 1.75,5.75; 54 1.25,5.75; 55 0.75,5.75; 56 0.25,5.75; 57 -0.25,5.75; 58 -0.75,5.75; 59 -1.25,5.75; 60 -1.75,5.75; 61 -2.25,5.75; 62 -2.75,5.75; 63 -3.25,5.75; 64 -3.75,5.75
SOT223 = smd 1.5 x 2: 1 -2.3,-3.15; 2 0,-3.15; 3 2.3,-3.15 | smd 3.8 x 2: 4 0,3.15
1X02 = drill 1.016 pad 1.88: 1 0,0; 2 2.54,0
CDRH2D09 = smd 1.3 x 1.3: P$1 -1.5,0; P$2 1.5,0
L1812 = smd 1.9 x 3.4: 1 -1.95,0; 2 1.95,0
JST-PH4 = drill 0.813 pad 1.422 octagon: 1 0,0; 2 -2,0; 3 -4,0; 4 -6,0
JST-PH5 = drill 0.813 pad 1.422 octagon: 1 0,0; 2 -2,0; 3 -4,0; 4 -6,0; 5 -8,0
JST-PH6 = drill 0.813 pad 1.422 octagon: 1 0,0; 2 -2,0; 3 -4,0; 4 -6,0; 5 -8,0; 6 -10,0
JST-PH2 = drill 0.813 pad 1.422 octagon: 1 0,0; 2 -2,0
SOT23 = smd 1 x 1.4: 1 -0.95,-1.1; 2 0.95,-1.1; 3 0,1.1
HC18U-V = drill 0.813: 1 -2.54,0; 2 2.54,0
TC38H = drill 0.813: 1 -1.27,0; 2 1.27,0
0603-RES = smd 1.1 x 1: 1 -0.85,0; 2 0.85,0
R0603 = smd 1 x 1.1: 1 -0.85,0; 2 0.85,0
SJ_2 = smd 1.168 x 1.6: 1 -1.524,0; 2 0,0; 3 1.524,0
SOT23-BEC = smd 1 x 1.4: B -0.95,-1.1; C 0,1.1; E 0.95,-1.1
ESP-WROOM-03 = smd 0.9 x 1.5: 1 7.7,9; 2 6.43,9; 3 5.16,9; 4 3.89,9; 5 2.62,9; 6 1.35,9; 7 0.08,9; 8 -1.19,9; 9 -2.46,9; 10 -3.73,9; 11 -5,9; 12 -6.27,9; 13 -7.54,9; 14 -8.81,9; 25 -8.81,-9; 26 -7.54,-9; 27 -6.27,-9; 28 -5,-9; 29 -3.73,-9; 30 -2.46,-9; 31 -1.19,-9; 32 0.08,-9; 33 1.35,-9; 34 2.62,-9; 35 3.89,-9; 36 5.16,-9; 37 6.43,-9; 38 7.7,-9 | smd 1.5 x 0.9: 15 -10.3,5.715; 16 -10.3,4.445; 17 -10.3,3.175; 18 -10.3,1.905; 19 -10.3,0.635; 20 -10.3,-0.635; 21 -10.3,-1.905; 22 -10.3,-3.175; 23 -10.3,-4.445; 24 -10.3,-5.715 | smd 6 x 6: GND 0,0
SOT23-5 = smd 0.55 x 1.2: 1 -0.95,-1.3; 2 0,-1.3; 3 0.95,-1.3; 4 0.95,1.3; 5 -0.95,1.3
QFN-10_PAD = smd 0.297 x 0.85: 1 -1,-1.475; 2 -0.5,-1.475; 3 0,-1.475; 4 0.5,-1.475; 5 1,-1.475; 6 1,1.475; 7 0.5,1.475; 8 0,1.475; 9 -0.5,1.475; 10 -1,1.475 | smd 0.7 x 0.28: 11 -1.5,0.25; 12 -1.5,-0.25; 13 1.5,0.25; 14 1.5,-0.25 | smd 2.4 x 1.65: 15 0,0
LEAD-QFN24 = smd 0.8 x 0.2: 1 -1.7,1; 2 -1.7,0.6; 3 -1.7,0.2; 4 -1.7,-0.2; 5 -1.7,-0.6; 6 -1.7,-1; 13 1.7,-1; 14 1.7,-0.6; 15 1.7,-0.2; 16 1.7,0.2; 17 1.7,0.6; 18 1.7,1 | smd 0.2 x 0.8: 7 -1,-1.7; 8 -0.6,-1.7; 9 -0.2,-1.7; 10 0.2,-1.7; 11 0.6,-1.7; 12 1,-1.7; 19 1,1.7; 20 0.6,1.7; 21 0.2,1.7; 22 -0.2,1.7; 23 -0.6,1.7; 24 -1,1.7 | smd 1.7 x 1.54: 25 0,0
47589-0001 = smd 1.35 x 0.4: 1 2.8,1.3; 2 2.8,0.65; 3 2.8,0; 4 2.8,-0.65; 5 2.8,-1.3 | drill 0.6 pad 0.95 long: CASING1 0,4.175; CASING2 0,-4.175 | drill 0.7 pad 1.1 square: CASING3 3,2.225; CASING4 3,-2.225

### Placement (x,y rotation side)
C1  10.16,2.54 0 top
C2  17.78,15.24 180 top
C3  8.89,18.41 180 top
C4  12.38,17.78 0 top
C5  9.53,54.61 270 top
C6  31.75,18.41 180 top
C7  44.45,13.97 270 top
C8  31.75,17.14 0 top
C9  13.97,5.08 0 top
C10  10.16,5.08 0 top
C11  45.72,15.88 90 top
C12  31.75,24.13 0 top
C13  49.53,29.84 180 top
C14  52.7,16.51 0 top
C15  38.1,31.75 90 top
C16  36.2,33.02 90 top
C17  50.16,38.73 270 top
C18  48.26,35.56 270 top
C19  43.18,33.02 180 bottom
C20  46.99,33.02 0 bottom
C21  25.4,28.57 0 top
C22  25.4,27.3 0 top
C23  28.57,26.04 180 top
C24  33.02,31.75 90 top
C25  14.61,28.57 0 top
C26  10.16,23.5 270 top
C27  10.79,57.78 0 top
C28  31.11,34.92 270 top
D1  48.9,53.34 180 top
D2  46.99,53.34 180 top
D3  45.09,53.34 180 top
D4  13.97,10.16 90 top
D5  43.18,53.34 180 top
D6  45.09,6.99 90 top
D7  45.09,8.89 90 top
F1  21.59,7.62 0 top
H5  3,3 0 top
H6  57,3 0 top
H7  57,57 0 top
H8  3,57 0 top
IC1  40.64,22.86 270 top
IC2  15.88,22.86 270 top
JP9  17.14,5.71 270 top
L1  8.89,14.61 270 top
L2  35.56,38.1 180 top
P1_GPS  42.55,2.54 180 top
P1_LIDAR_DATA  57.15,21.59 270 top
P2  57.15,31.11 270 top
P2_ACTOR  3.17,39.37 90 top
P2_ACTOR1  57.15,43.18 270 top
P2_ACTOR2  50.8,57.15 0 top
P3_ESP32_PROG  3.17,52.07 90 top
P4_LIDAR_MOTOR  3.17,24.77 90 top
P4_PWRSW1  3.17,18.41 90 top
P4_PWRSW2  3.17,12.06 90 top
Q1  6.99,24.13 180 top
Q2  44.45,37.47 270 top
Q3  45.09,31.11 180 bottom
Q4  7.62,29.84 90 top
Q5  7.62,33.02 90 top
Q6  7.62,36.2 90 top
Q7  7.62,39.37 90 top
Q8  7.62,42.55 90 top
R1  17.78,17.78 0 top
R2  6.35,16.19 90 top
R3  17.78,12.7 0 top
R4  17.78,11.43 180 top
R5  13.97,8.89 0 top
R6  17.78,16.51 180 top
R7  8.89,27.3 0 top
R8  54.61,22.23 180 top
R9  10.16,10.16 0 top
R10  54.61,24.13 180 top
R11  35.56,50.8 270 top
R12  37.47,53.34 270 top
R13  36.83,41.91 0 top
R14  11.43,54.61 90 top
R15  27.94,37.47 180 top
R16  52.7,17.78 180 top
R17  48.26,38.73 270 top
R18  29.21,8.26 0 top
R19  29.21,10.16 0 top
R20  38.73,5.71 90 top
R21  50.8,27.94 180 top
R22  30.48,21.59 0 top
R23  33.66,7.62 90 top
R24  36.2,9.53 90 top
R25  31.75,7.62 270 top
R26  37.47,1.91 270 top
R27  34.92,1.91 90 top
R28  20.95,10.16 180 top
R29  24.13,10.16 180 top
R30  6.35,51.44 90 top
R31  11.43,48.9 0 top
R32  52.7,34.29 0 top
R33  52.7,36.2 0 top
R34  13.34,31.11 180 top
R35  13.34,33.02 180 top
R36  13.34,34.92 180 top
R37  13.34,36.83 180 top
R38  13.34,38.73 180 top
R39  48.9,50.16 270 top
R40  46.99,50.16 270 top
R41  45.09,50.16 270 top
R42  43.18,50.16 270 top
R43  48.26,6.99 180 top
R44  48.26,8.89 180 top
SJ1  52.07,29.84 180 bottom
SJ2  27.3,21.59 270 bottom
SJ3  6.35,29.21 270 bottom
SWD  57.15,7.62 270 top
T1  32.38,3.81 180 top
T2  36.2,5.71 0 top
T3  10.16,51.44 270 top
T4  11.43,45.72 180 top
U1  24.13,50.8 90 top
U2  10.16,7.62 270 top
U3  13.34,14.61 270 top
U$1  30,30 0 top
U$2  25.4,1.91 90 top

### Tracks (layer width: path | path; a pad name or v marks a point on that pad's centre or on a via)
5VIN  (via drill 0.5)
  Top 0.305: U2.4 13.34,6.67 13.12,6.46 | F1.1 20.19,7.75 20.32,8.26 | 20.32,10.16 R28.2 20.32,9.95
  Top 0.406: R24.2 33.23,10.38 v33.02,10.16
  Top 0.61: 13.34,6.67 17.14,6.67 | JP9.1 17.14,6.67 | D4.A R28.2 | v20.32,11.43 20.32,10.16 | 20.32,8.26 20.32,9.95 | 17.14,6.67 19.24,6.67 F1.1 | C9.1 13.12,6.46
  Bottom 0.406: v33.02,10.16 21.59,10.16 v20.32,11.43
+3V3  (via drill 0.5)  (3 unrouted)
  Top 0.2: R13.2 37.47,41.91 | U$1.8 29.4,27.5 | U$1.13 32.81,29 v33.02,29.21 | 46.39,28.54 46.35,28.57 46.32,28.61 | R32.1 51.85,34.08 | 34.92,19.05 34.89,19.09 IC1.32 35.5,19.11 | 44.46,16.73 IC1.48 | C13.2 48.05,30.06 47.94,30.16
  Top 0.254: v38.1,36.2 38.1,37.51 | 38.89,31.81 C15.2 36.28,34.42 C16.2 36.2,35.52 L2.2
  Top 0.305: 19.05,22.86 IC2.4 | 29.4,27.5 29.21,27.3 v27.3,27.3 C22.2 | v33.02,26.04 33.45,25.61 IC1.19 35.98,25.61 36.83,24.77 36.83,19.05 | v33.02,26.04 v33.02,29.21 C24.1 | IC1.64 46.39,28.54 | IC1.1 46.32,28.61 | IC1.48 44.39,18.48 43.81,19.05 36.83,19.05 | 36.83,19.05 35.56,19.05 35.5,19.11 | C12.2 32.6,25.61 v33.02,26.04 | 32.22,2.54 T1.C
  Top 0.406: 51.85,34.08 47.94,30.16 46.35,28.57 | v31.11,41.91 31.11,52.07 25.95,57.23 U1.2 12.7,57.23 | 34.92,19.05 34.92,17.14 | 34.92,17.14 v34.92,16.51 | C11.2 44.46,16.73 | C8.2 34.92,17.14 | R16.2 50.16,17.78 v48.9,19.05 | P2_ACTOR1.1 54.61,43.18 51.85,40.42 R33.1 R32.1 v50.8,34.29 | v38.1,36.2 38.1,38.1 | 12.7,57.23 12.14,57.23 12.06,57.15 12.06,57.53 C27.+ | R14.2 11.43,55.96 12.7,57.23 | 37.68,38.1 R13.2 | 37.47,41.91 v37.47,43.18 | 32.22,2.54 v33.34,2.54 | L2.1 L2.2
  Top 0.61: C21.2 C22.2 26.25,26.25 v25.4,25.4 | R27.1 34.04,1.05 T1.C | 19.05,22.86 v19.05,25.4 19.05,26.67 17.14,28.57 C25.+
  Top 1.27: IC2.2 IC2.4
  Bottom 0.2: v34.92,16.51 34.89,16.51 34.89,16.48 v34.92,16.51
  Bottom 0.305: SJ2.1 27.3,23.5 | SJ1.1 50.8,29.84
  Bottom 0.406: v33.02,26.04 31.75,27.3 v27.3,27.3 | v33.02,29.21 37.47,24.77 42.55,24.77 48.26,19.05 v48.9,19.05 50.8,20.95 50.8,29.84 v50.8,34.29 48.26,36.83 38.73,36.83 v38.1,36.2 | v31.11,41.91 36.2,41.91 v37.47,43.18 | SWD.1 50.16,7.62 41.27,16.51 v34.92,16.51 34.92,12.06 40.64,6.35 40.64,2.54 40.32,2.22 33.66,2.22 v33.34,2.54 | P2_ACTOR2.1 50.8,55.24 54.61,51.44 54.61,43.81 55.24,43.18 P2_ACTOR1.1
  Bottom 0.61: 27.3,23.5 v25.4,25.4 v19.05,25.4 17.78,26.67 10.16,26.67 8.89,27.94 8.89,29.84 8,30.73 SJ3.1
+5V  (via drill 0.5)
  Top 0.2: 18.43,19.04 18.43,19.07 | 19.04,19.07 v19.05,19.05
  Top 0.254: R1.2 18.41,17.78 18.43,17.8 | 18.43,19.04 18.41,19.05
  Top 0.305: U3.2 10.93,15.11 10.16,15.88 10.16,18.79 C3.1 10.19,18.02 10.19,19.05 10.16,19.05 | 10.16,20.32 10.4,20.56 10.16,20.56
  Top 0.406: 10.16,20.56 10.16,20.32
  Top 0.61: 10.16,20.32 10.16,19.05 | IC2.3 10.4,20.56 | P4_LIDAR_MOTOR.1 1.91,24.77 1.27,24.13 1.27,21.59 2.3,20.56 10.16,20.56 C26.+ | 18.43,17.8 18.43,19.04 | 18.41,19.05 10.19,19.05 | 18.43,19.07 19.04,19.07 | P1_GPS.1 42.55,3.17 43.81,4.45 49.53,4.45 55.24,10.16 55.24,19.68 P1_LIDAR_DATA.1
  Bottom 0.254: P2.1 56.52,31.11
  Bottom 0.406: P1_GPS.1 41.27,1.27 32.38,1.27 31.11,2.54 31.11,6.99 29.84,8.26 20.95,8.26 19.05,10.16 19.05,12.7 19.68,13.34 19.68,18.41 v19.05,19.05 | 56.52,31.11 55.24,29.84 55.24,22.86 56.52,21.59 P1_LIDAR_DATA.1
  Bottom 0.813: P4_LIDAR_MOTOR.1 4.45,24.77 6.35,26.67 SJ3.3
BOOT0
  Top 0.305: IC1.60 47.47,24.61 49.53,26.67 49.53,27.52 R21.2
BOOT1
  Top 0.305: IC1.28 31.81,21.11 R22.2
D+
  Top 0.305: R18.1 27.3,8.26 25.4,6.35 U$2.3
D-
  Top 0.305: R19.1 27.3,10.16 24.75,7.61 U$2.2
DISC  (via drill 0.5)
  Top 0.254: IC1.25 27.05,22.61 25.4,20.95 v25.4,20.32
  Top 0.406: R26.2 38.52,1.05 39.37,1.91 v39.37,3.17
  Bottom 0.406: v25.4,20.32 25.4,17.78 29.21,13.97 31.11,13.97 39.37,5.71 v39.37,3.17
EINT
  Top 0.305: IC1.54 49.55,21.61 55.24,27.3 55.24,31.75
  Top 0.406: P2.2 56.61,33.12 55.24,31.75
EN  (via drill 0.5)  (1 unrouted)
  Top 0.305: U3.6 14.81,12.49 v15.24,12.06 | v6.35,18.41 6.37,18.41
  Top 0.61: 6.37,18.41 R2.2
  Top 0.813: P4_PWRSW1.1 v6.35,18.41
  Bottom 0.406: v15.24,12.06 6.99,12.06 6.35,12.7 v6.35,18.41
ESP_DTR  (via drill 0.5)
  Top 0.254: 6.16,48.07 6.35,48.26
  Top 0.305: IC1.14 37.89,27.52 38.73,26.67 v38.73,26.04
  Top 0.406: P3_ESP32_PROG.3 6.16,48.07 | v8.89,45.53 6.96,45.53 6.35,46.16 6.35,48.26 R30.1 | 9.06,45.7 v8.89,45.53 | v8.89,45.53 9.08,45.53 10.16,44.45 11.26,44.45 T4.C
  Bottom 0.2: v8.89,45.53 8.89,45.72
  Bottom 0.406: v38.73,26.04 38.73,27.94 34.29,32.38 14.61,32.38 8.89,38.1 v8.89,45.53
ESP_EN
  Top 0.406: U1.3 14.05,55.96 11.85,53.76 R14.1 | C5.2 R14.1 | T3.C 11.26,53.59 R14.1
ESP_RTS  (via drill 0.5)
  Top 0.305: IC1.15 37.39,26.75 v37.47,26.67
  Top 0.406: R31.1 8.89,48.9 | 8.89,48.9 8.26,48.9 v7.62,48.26 | T3.E 9.06,49.06 8.89,48.9
  Bottom 0.2: 7.33,46.07 7.62,46.35
  Bottom 0.406: v37.47,26.67 33.02,31.11 14.61,31.11 7.62,38.1 7.62,46.35 v7.62,48.26 | P3_ESP32_PROG.4 7.33,46.07
ESP_RX  (via drill 0.5)
  Top 0.2: IC1.16 36.8,28.61 34.92,30.48 34.92,33.34 34.61,33.66 v34.61,34.92
  Top 0.406: v40.64,45.09 37.47,45.09 35.56,46.99 R11.2
  Bottom 0.406: v34.61,34.92 34.61,35.88 40.64,41.91 v40.64,45.09
ESP_RXD  (via drill 0.5)
  Top 0.305: 35.77,53.34 v35.56,53.34
  Top 0.406: U1.34 34.21,53.42 34.29,53.34 v35.56,53.34 R11.1
  Bottom 0.254: 34.37,54.61 34.37,54.53
  Bottom 0.406: 34.37,54.61 8.26,54.61 3.71,50.07 P3_ESP32_PROG.2 | 34.37,54.53 v35.56,53.34
ESP_TX  (via drill 0.5)
  Top 0.2: IC1.17 34.89,27.34 34.29,27.94 34.29,33.02 33.34,33.97 v33.34,34.92
  Top 0.406: R12.2 37.47,48.26 v39.37,46.35
  Bottom 0.406: v33.34,34.92 33.34,35.88 39.37,41.91 v39.37,46.35
ESP_TXD  (via drill 0.5)
  Top 0.406: R12.1 37.47,54.61 37.33,54.69 U1.35 31.75,54.69 v30.48,55.88
  Bottom 0.406: P3_ESP32_PROG.1 3.81,52.07 7.62,55.88 v30.48,55.88
FB
  Top 0.305: U3.10 15.61,15.61 16.51,16.51 R6.2 R1.1
GND  (via drill 0.5)
  Top 0.2: U3.4 13.45,14.11 13.59,13.97 | U3.11 13.59,15.24 13.59,14.86 U3.15 | U3.14 U3.13 13.59,11.81 | 26.67,31.11 26.79,31 U$1.1 27.42,31 27.3,31.11 | U$1.25 29.8,30.2 U$1.22 29.8,32.34 30.16,32.7 | 32.92,32.7 C24.2
  Top 0.254: R44.1 48.9,8.89 | U1.GND v24.77,50.16 | U3.9 13.72,15.11 13.59,15.24 | 38.39,30.19 38.1,30.48 C15.1 37.38,31.62 C16.1
  Top 0.305: U3.11 13.59,17.55 C4.2 13.09,17.52 U3.12 | U3.13 13.59,13.97 13.59,14.61 U3.15
  Bottom 0.406: SJ2.3 28.83,20.07 v29.21,20.32
  other vias: 15.24,17.78 30,30 46.35,34.29 27.94,17.14 22.23,52.7 22.23,48.9 26.04,48.9 26.04,52.7 24.77,51.44 6.99,57.78 12.7,52.07 20.95,58.42 27.94,58.42 36.83,58.42 51.44,51.44 42.55,47.62 48.26,41.91 53.98,40.01 52.7,19.68 53.34,10.79 51.44,2.54 48.26,5.71 41.91,5.71 19.68,1.91 41.27,20.95 45.09,27.3 21.59,4.45 6.99,5.08 17.14,8.26 13.34,14.61 13.34,28.57 12.7,40.64 21.59,33.66 48.26,27.94 38.42,34.61 23.5,48.9 24.77,48.9 22.23,50.16 23.5,50.16 26.04,50.16 22.23,51.44 23.5,51.44 23.5,52.7 24.77,52.7 26.04,51.44 25.4,29.84 14.61,24.77 15.88,24.77 17.14,24.77 3.17,26.67
  pour Top: 0,60.33 60.33,60.33 60.33,0 0,0
  pour Bottom: 0,60.33 60.33,60.33 60.33,0 0,0
IO0  (via drill 0.5)
  Top 0.406: v33.02,40.64 33.02,41.91 32.94,41.99 U1.25 35.98,41.99 R13.1 | T4.E 10.48,47.31 v9.53,46.99
  Bottom 0.406: v9.53,46.99 15.88,40.64 v33.02,40.64
IO2
  Top 0.406: U1.24 29.84,38.1 29.21,37.47 R15.1
LIDAR_PWM  (via drill 0.5)
  Top 0.305: IC1.51 39.58,20.11 v38.1,21.59
  Top 0.406: R7.2 v10.79,27.94
  Bottom 0.406: v10.79,27.94 24.77,27.94 30.48,22.23 37.47,22.23 v38.1,21.59
LIDAR_RX
  Top 0.305: IC1.53 50.32,21.11 53.34,24.13 R10.2
LIDAR_TX
  Top 0.305: IC1.52 51.09,20.61 52.7,22.23 R8.2
M1
  Top 0.254: R38.1 14.61,38.73 23.5,29.84 23.5,20.32 24.77,19.05 29.21,19.05 30.27,20.11 IC1.30
M2
  Top 0.254: R37.1 15.24,36.83 22.86,29.21 22.86,19.68 27.94,14.61 35.56,14.61 36.89,15.94 IC1.33
M3
  Top 0.254: R36.1 15.88,34.92 22.23,28.57 22.23,19.05 27.3,13.97 35.56,13.97 37.39,15.8 IC1.34
M4
  Top 0.254: R35.1 16.51,33.02 21.59,27.94 21.59,18.41 26.67,13.34 35.56,13.34 37.89,15.66 IC1.35
M5
  Top 0.254: R34.1 17.14,31.11 20.95,27.3 20.95,17.78 26.04,12.7 35.56,12.7 38.39,15.53 IC1.36
MPU_INT  (via drill 0.5)
  Top 0.2: U$1.12 31,25.52 v31.11,25.4
  Top 0.305: IC1.57 43.43,23.11 42.16,21.84 39.76,21.84 v38.1,23.5
  Bottom 0.406: v31.11,25.4 33.02,23.5 v38.1,23.5
N$1
  Top 0.305: U3.1 11.86,17.59 C4.1
N$2
  Top 0.305: U3.3 9.53,14.61 8.89,15.24 L1.P$1
N$3
  Top 0.254: U$1.20 30.6,32.51 31.11,33.02 C28.2
N$4
  Top 0.305: 6.72,22.77 Q1.3
  Top 0.813: P4_LIDAR_MOTOR.2 6.72,22.77
N$5
  Top 0.2: 7.93,27.2 R7.1
  Top 0.406: Q1.1 7.93,27.2
N$6
  Top 0.406: R8.1 55.78,22.23 P1_LIDAR_DATA.2
N$7
  Top 0.406: P1_LIDAR_DATA.3 56.07,25.59 55.46,24.98 R10.1
N$8
  Top 0.61: R9.2 D4.C
N$9
  Top 0.2: U$1.10 30.2,27.02 29.21,26.04 29.21,25.82 C23.1
N$10
  Top 0.254: IC1.8 40.89,39.62 45.09,43.81 52.7,43.81 54.07,45.18 P2_ACTOR1.2
N$11
  Top 0.305: U2.5 13,8.57 R5.1
N$12
  Top 0.406: P2_ACTOR.5 5,31.37 Q4.3
N$13
  Top 0.406: R31.2 12.28,46.92 T4.B
N$14
  Top 0.305: U2.1 8.86,10.14 R9.1
N$15
  Top 0.406: P2_ACTOR.4 6.17,33.37 Q5.3
N$16
  Top 0.254: IC1.6 41.89,37.45 Q2.1
  Top 0.406: Q2.1 47.84,40.01 R17.1 C17.1
N$17
  Top 0.406: P2_ACTOR.3 5.7,35.37 Q6.3
N$18
  Top 0.406: P2_ACTOR.2 4.52,37.37 Q7.3
N$19
  Top 0.2: 48.48,36.2 C18.1
  Top 0.254: IC1.5 42.39,32.87 Q2.2
  Top 0.406: Q2.2 45.72,36.2 48.48,36.2 | C18.1 R17.2
N$20
  Top 0.254: IC1.4 42.89,30.19 Q3.1
  Bottom 0.2: 43.81,32.8 C19.2
  Bottom 0.406: Q3.1 43.81,32.8
N$21
  Top 0.254: IC1.3 43.39,29.42 43.81,29.84 45.09,29.84 Q3.2
  Bottom 0.2: 46.35,32.8 C20.2
  Bottom 0.406: Q3.2 46.35,32.8
N$22
  Top 0.305: 36.15,6.77 T2.C | 38.69,6.82 R20.2 | 33.34,6.45 R23.1
  Top 0.406: R23.1 36.15,6.77 | T2.C 38.69,6.82 | T1.B 33.34,6.45
N$23  (via drill 0.5)
  Top 0.406: R21.1 51.65,28.16 52.07,28.57 SJ1.2
  other vias: 52.07,29.84
N$24  (via drill 0.5)
  Top 0.305: R22.1 v27.94,21.59
  Bottom 0.305: SJ2.2 v27.94,21.59
N$25
  Top 0.406: 3.35,39.37 Q8.3
  Top 0.61: P2_ACTOR.1 3.35,39.37
N$26
  Top 0.305: 31.43,6.46 R25.2
  Top 0.406: T1.E 31.43,6.46
N$27
  Top 0.305: 33.86,8.68 R23.2
  Top 0.406: R24.1 33.86,8.68
N$28
  Top 0.305: 34.92,4.29 T2.B
  Top 0.406: 34.92,4.29 R27.2 R26.1
N$29
  Top 0.406: R30.2 8.96,52.28 T3.B
N$30
  Bottom 0.813: SJ3.2 3.33,29.21 P2_ACTOR.6
N$31
  Top 0.406: Q4.1 10.27,28.89 R34.2
N$32
  Top 0.305: 12.06,33.02 R35.2
  Top 0.406: Q5.1 11.11,32.07 12.06,33.02
N$33
  Top 0.406: Q6.1 11.11,35.24 11.43,34.92 R36.2
N$34
  Top 0.406: Q7.1 9.84,38.42 11.43,36.83 R37.2
N$35
  Top 0.406: Q8.1 9.84,41.59 12.06,39.37 12.06,39.16 R38.2
N$36
  Top 0.254: IC1.9 40.39,40.39 45.09,45.09 52.7,45.09 54.8,47.18 P2_ACTOR1.3
N$37
  Top 0.254: IC1.10 39.89,41.16 45.09,46.35 52.7,46.35 55.53,49.18 P2_ACTOR1.4
N$38
  Top 0.254: IC1.11 39.39,41.93 44.83,47.37 52.45,47.37 56.26,51.18 P2_ACTOR1.5
N$39  (via drill 0.5)
  Top 0.254: D5.A 43.18,56.77 P2_ACTOR2.5
  Top 0.406: U1.10 16.43,47.07 v16.51,46.99
  Bottom 0.254: 42.8,56.77 P2_ACTOR2.5
  Bottom 0.406: v16.51,46.99 33.02,46.99 42.8,56.77
N$40  (via drill 0.5)
  Top 0.254: D3.A 45.09,56.87 P2_ACTOR2.4
  Top 0.406: U1.11 16.43,45.8 v16.51,45.72
  Bottom 0.254: P2_ACTOR2.4 44.8,56.87
  Bottom 0.406: v16.51,45.72 33.02,45.72 43.18,55.88 43.81,55.88 44.8,56.87
N$41  (via drill 0.5)
  Top 0.254: D2.A 46.99,56.96 P2_ACTOR2.3
  Top 0.406: U1.12 16.43,44.53 v16.51,44.45
  Bottom 0.254: P2_ACTOR2.3 46.8,56.96
  Bottom 0.406: v16.51,44.45 33.02,44.45 43.18,54.61 44.45,54.61 46.8,56.96
N$42  (via drill 0.5)
  Top 0.254: D1.A 48.9,57.05 P2_ACTOR2.2
  Top 0.406: U1.13 16.43,43.26 v16.51,43.18
  Bottom 0.406: v16.51,43.18 33.02,43.18 43.18,53.34 45.72,53.34 48.8,56.42 P2_ACTOR2.2
N$43
  Top 0.254: D1.C R39.1
N$44
  Top 0.254: D2.C R40.1
N$45
  Top 0.254: D3.C R41.1
N$46
  Top 0.254: D5.C R42.1
N$48  (via drill 0.5)
  Top 0.254: IC1.37 38.89,15.39 37.47,13.97 v37.47,13.34
  Top 0.61: D6.C v41.91,6.99
  Bottom 0.406: v37.47,13.34 37.47,11.43 v41.91,6.99
N$49  (via drill 0.5)
  Top 0.305: IC1.38 39.39,13.99 v38.73,13.34
  Top 0.61: D7.C v41.91,8.89
  Bottom 0.406: v38.73,13.34 38.73,12.06 v41.91,8.89
N$50
  Top 0.61: D6.A R43.2
N$51
  Top 0.61: R44.2 D7.A
NRST  (via drill 0.5)
  Top 0.254: C14.2 R16.1 | 53.55,15.77 53.34,15.56 v53.34,15.62
  Top 0.305: IC1.7 41.39,23.61 v41.27,23.5
  Top 0.406: R16.1 53.55,15.77
  Bottom 0.406: SWD.5 v53.34,15.62 49.15,15.62 v41.27,23.5
SCL  (via drill 0.5)
  Top 0.2: U$1.23 29.4,33.84 v29.21,34.29
  Top 0.254: R32.2 53.55,34.05
  Top 0.305: IC1.58 47.51,23.61 v48.26,22.86 49.53,22.86 53.98,27.3 53.98,33.63 53.55,34.05
  Top 0.406: P2.3 56.07,35.12 55.24,34.29 R32.2
  Bottom 0.305: v29.21,34.29 30.48,33.02 36.83,33.02 46.35,22.86 v48.26,22.86
SDA  (via drill 0.5)
  Top 0.2: 46.37,24.12 46.35,24.13 | IC1.59 48.24,24.11 v48.26,24.13 v48.25,24.12 | U$1.24 29,32.49 26.67,34.61 v26.67,35.56
  Top 0.305: 53.34,31.75 53.34,27.94 49.53,24.13 v48.26,24.13 | 46.37,24.12 v48.25,24.12
  Top 0.406: 53.34,31.75 v52.7,32.38 | P2.4 55.53,37.12 54.61,36.2 R33.2
  Bottom 0.305: v26.67,35.56 29.84,35.56 31.75,33.66 37.47,33.66 46.35,24.13 v48.26,24.13
  Bottom 0.406: P2.4 54.9,37.12 52.7,34.92 v52.7,32.38
SWCLK  (via drill 0.5)
  Top 0.2: IC1.49 46.35,19.07 46.97,19.07
  Top 0.305: 46.97,19.07 47.62,18.41 v47.62,12.7
  Bottom 0.406: SWD.2 50.7,9.62 v47.62,12.7
SWDIO  (via drill 0.5)
  Top 0.305: IC1.46 43.39,12.49 44.45,11.43 v51.44,11.43
  Bottom 0.406: SWD.4 53.62,13.62 v51.44,11.43
TRACESWO  (via drill 0.5)
  Top 0.305: IC1.55 44.97,22.11 v44.45,21.59
  Bottom 0.406: SWD.6 48.42,17.62 v44.45,21.59
UART1_TX  (via drill 0.5)
  Top 0.305: IC1.42 41.39,15.36 v40.96,14.92
  Bottom 0.406: P1_GPS.2 44.55,8.16 40.01,13.02 40.01,13.97 v40.96,14.92
UART2_RX  (via drill 0.5)
  Top 0.305: IC1.43 41.89,14.27 v41.27,13.65
  Bottom 0.305: 46.35,2.73 P1_GPS.3
  Bottom 0.406: v41.27,13.65 46.35,8.26 46.35,2.73
USB_D+
  Top 0.305: IC1.45 42.89,12.41 41.91,11.43 33.02,11.43 31.75,10.16 R25.1 | 31.75,8.26 R25.1 | R18.2 30.06,8.47 30.48,8.26 31.54,8.26 R25.1
USB_D-
  Top 0.305: IC1.44 42.39,13.18 41.27,12.06 31.75,12.06 30.06,10.38 R19.2
USBP_E  (via drill 0.5)
  Top 0.254: 26.92,23.11 26.29,23.11
  Top 0.305: IC1.24 26.92,23.11 | 26.29,23.11 v24.77,21.59
  Top 0.61: R28.1 R29.2 23.28,11.01 v23.5,11.43
  Bottom 0.406: v23.5,11.43 23.5,20.32 v24.77,21.59
UVLO
  Top 0.305: 16.93,13.97 R3.1 R4.2 | 16.93,13.97 C2.2 | U3.7 16.8,14.11 16.93,13.97
VBATT  (via drill 0.5)
  Top 0.254: U3.5 11.06,13.61
  Top 0.305: 8.76,6.57 U2.3 | C10.1 8.76,5.08 | R3.2 18.63,13.97 | 18.63,13.97 C2.1 | v17.78,13.97 18.63,13.97
  Top 0.406: 11.06,13.61 10.16,12.7 9.29,12.7 L1.P$2
  Top 0.61: L1.P$2 7.85,13.11 v7.62,13.34 6.35,13.34 | 6.35,12.06 6.35,13.34 | 6.35,13.34 R2.1 | P4_PWRSW2.1 6.35,12.06 | 6.35,12.06 6.35,7.62 7.3,6.67 U2.3 | C1.1 8.76,5.08 8.76,6.57
  Bottom 0.406: v7.62,13.34 17.14,13.34 v17.78,13.97
VBUS
  Top 0.305: F1.2 23.88,6.73 24.1,6.51 U$2.1
VCAP1
  Top 0.305: IC1.31 33.58,19.61 32.38,18.41 C6.1
VCAP2
  Top 0.305: IC1.47 43.89,15.38 C7.1